# Altium project BridgeArduinoNano.PrjPcb
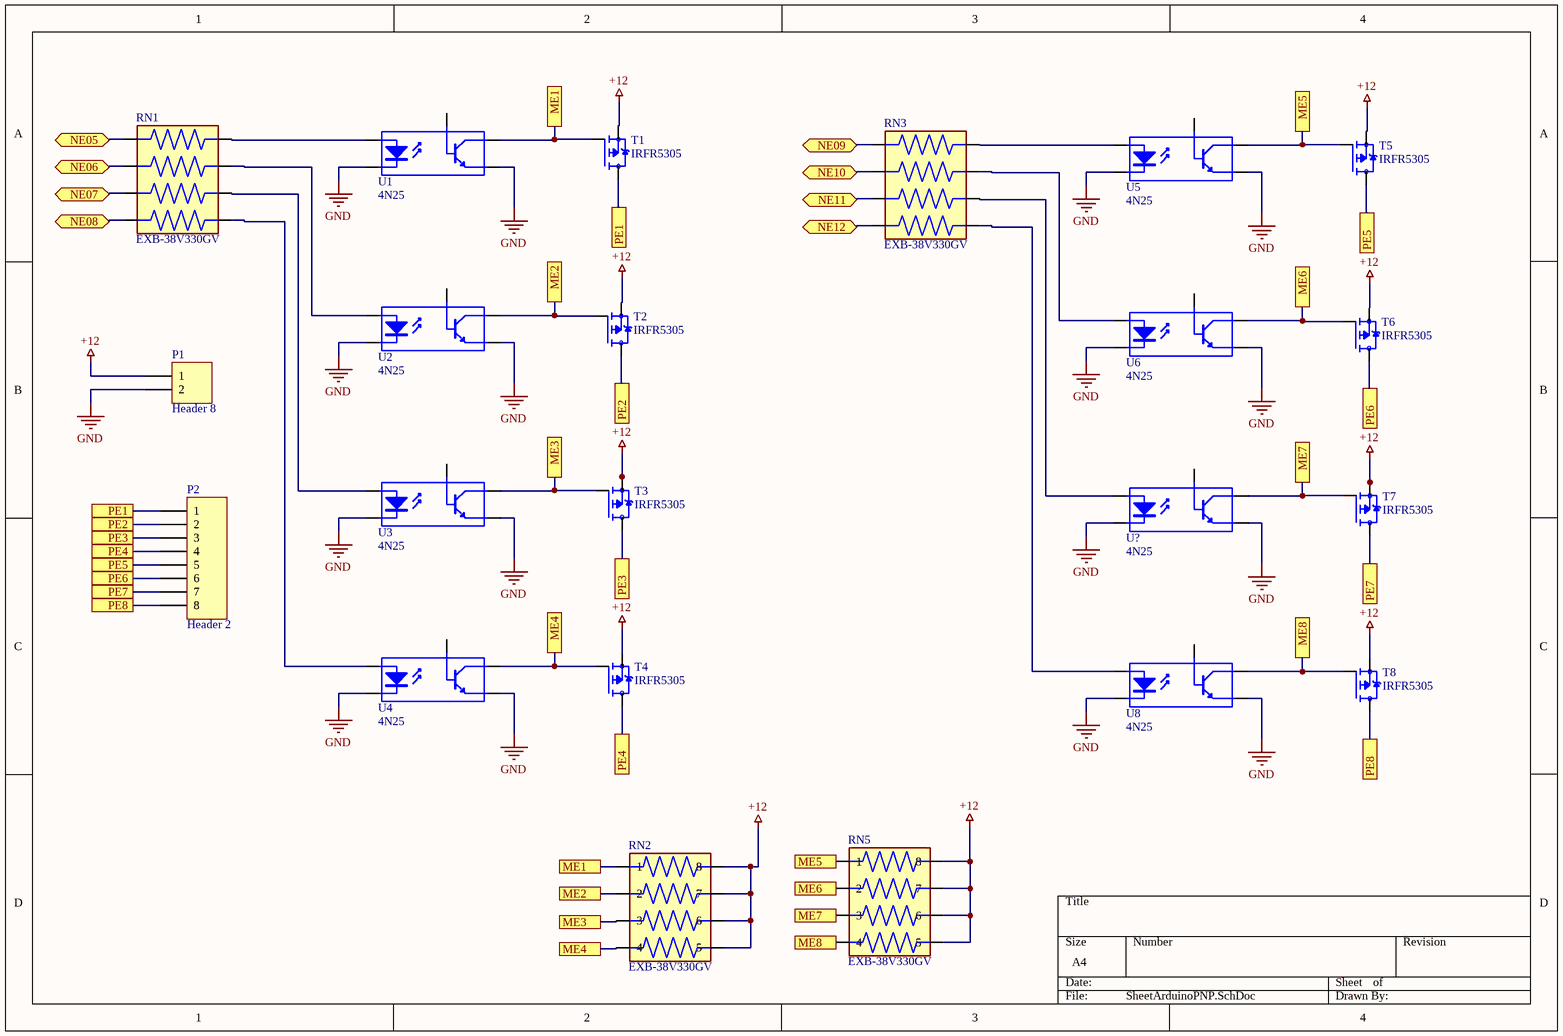
[diagram p0: SheetArduinoPNP.SchDoc]
4 sheets, 70 parts. Net scope: flat (ports and power ports of the same name join across sheets).
Board file: PCB1.PcbDoc
Sheets:
  SheetArduinoPNP.SchDoc
  SheetArduinoNPN.SchDoc
  SheetArduinoUSB.SchDoc
  SheetArduinoESP32.SchDoc

## Sheet SheetArduinoPNP.SchDoc
size A4

### Parts
P1  Header 8  [HDR1X2]
P2  Header 2  [HDR1X8]
RN1  EXB-38V330GV  [RESCAXS80P320X160X60-8N]
RN2  EXB-38V330GV  [RESCAXS80P320X160X60-8N]
RN3  EXB-38V330GV  [RESCAXS80P320X160X60-8N]
RN5  EXB-38V330GV  [RESCAXS80P320X160X60-8N]
T1  IRFR5305  [D-PAK_TO252AA]
T2  IRFR5305  [D-PAK_TO252AA]
T3  IRFR5305  [D-PAK_TO252AA]
T4  IRFR5305  [D-PAK_TO252AA]
T5  IRFR5305  [D-PAK_TO252AA]
T6  IRFR5305  [D-PAK_TO252AA]
T7  IRFR5305  [D-PAK_TO252AA]
T8  IRFR5305  [D-PAK_TO252AA]
U1  4N25  [SOP5(6)]
U2  4N25  [SOP5(6)]
U3  4N25  [SOP5(6)]
U4  4N25  [SOP5(6)]
U5  4N25  [SOP5(6)]
U6  4N25  [SOP5(6)]
U8  4N25  [SOP5(6)]
U?  4N25  [SOP5(6)]

### Ports
ME1, ME2, ME3, ME4, ME5, ME6, ME7, ME8, NE05 (bidir), NE06 (bidir), NE07 (bidir), NE08 (bidir), NE09 (bidir), NE10 (bidir), NE11 (bidir), NE12 (bidir), PE1, PE2, PE3, PE4, PE5, PE6, PE7, PE8

### Nets
+12: P1.1 RN2.5 RN2.6 RN2.7 RN2.8 RN5.5 RN5.6 RN5.7 RN5.8 T1.3(S) T2.3(S) T3.3(S) T4.3(S) T5.3(S) T6.3(S) T7.3(S) T8.3(S)
GND: P1.2 U1.3(K) U1.4(E) U2.3(K) U2.4(E) U3.3(K) U3.4(E) U4.3(K) U4.4(E) U5.3(K) U5.4(E) U6.3(K) U6.4(E) U8.3(K) U8.4(E) U?.3(K) U?.4(E)
NetJ1_02: RN3.1 ; port NE09
NetJ1_04: RN3.2 ; port NE10
NetJ1_06: RN3.3 ; port NE11
NetJ1_08: RN3.4 ; port NE12
NetJ1_09: RN1.1 ; port NE05
NetJ1_11: RN1.2 ; port NE06
NetJ1_13: RN1.3 ; port NE07
NetJ1_15: RN1.4 ; port NE08
NetP2_1: P2.1 T1.4(D) ; port PE1
NetP2_2: P2.2 T2.4(D) ; port PE2
NetP2_3: P2.3 T3.4(D) ; port PE3
NetP2_4: P2.4 T4.4(D) ; port PE4
NetP2_5: P2.5 T5.4(D) ; port PE5
NetP2_6: P2.6 T6.4(D) ; port PE6
NetP2_7: P2.7 T7.4(D) ; port PE7
NetP2_8: P2.8 T8.4(D) ; port PE8
NetRN1_5: RN1.5 U4.5(C)
NetRN1_6: RN1.6 U3.5(C)
NetRN1_7: RN1.7 U2.5(C)
NetRN1_8: RN1.8 U1.5(C)
NetRN2_1: RN2.1 T1.1(G) U1.1(A) ; port ME1
NetRN2_2: RN2.2 T2.1(G) U2.1(A) ; port ME2
NetRN2_3: RN2.3 T3.1(G) U3.5(C) ; port ME3
NetRN2_4: RN2.4 T4.1(G) U4.1(A) ; port ME4
NetRN3_5: RN3.5 U8.5(C)
NetRN3_6: RN3.6 U?.5(C)
NetRN3_7: RN3.7 U6.5(C)
NetRN3_8: RN3.8 U5.5(C)
NetRN5_1: RN5.1 T5.1(G) U5.1(A) ; port ME5
NetRN5_2: RN5.2 T6.1(G) U6.1(A) ; port ME6
NetRN5_3: RN5.3 T7.1(G) U?.1(A) ; port ME7
NetRN5_4: RN5.4 T8.1(G) U8.1(A) ; port ME8

Not connected (* = marked no-connect by the designer): U1 6(B); U2 6(B); U3 6(B); U4 6(B); U5 6(B); U6 6(B); U8 6(B); U? 6(B)

### Library data of the parts
P1 = Header 2: Header, 2-Pin; LatestRevisionDate: 17-Jul-2002; LatestRevisionNote: Re-released for DXP Platform.; Publisher: Altium Limited
P2 = Header 8: Header, 8-Pin; LatestRevisionDate: 17-Jul-2002; LatestRevisionNote: Re-released for DXP Platform.; Publisher: Altium Limited
RN1-RN3 RN5 = EXB-38V330GV: Resistor Array, Chip, 4 elements CONVEX 1206 2%; MF: Panasonic; SnapEDA_Link: https://www.snapeda.com/parts/EXB-38V330GV/Panasonic/view-part/1421932/?ref=snap; Price: None; MP: EXB-38V330GV; Package: 0603 Panasonic; Value: *; Check_prices: https://www.snapeda.com/parts/EXB-38V330GV/Panasonic/view-part/1421932/?ref=eda; Availability: Bad
T1-T8 = IRFR5305: P-Channel 55V 31A _Tc_ 110W _Tc_ Surface Mount D-Pak; MF: Infineon Technologies; Availability: Unavailable; Value: *; Package: TO-252-3 Infineon Technologies; Price: None; SnapEDA_Link: https://www.snapeda.com/parts/IRFR5305/Infineon%20Technologies/view-part/2877715/?ref=snap; MP: IRFR5305
U1-U6 U8 U? = Optoisolator2: 5 Pin Mini Flat Pack Optocoupler; Published: 24-Mar-1999; LatestRevisionDate: 04-Mar-2005; LatestRevisionNote: PCB Footprint replaced, Sch pins re-numbered.; DatasheetVersion: Apr-2004; PackageReference: SOP5(6); Publisher: Altium Limited; PackageDescription: Small Outline; 6 Leads (1 Absent); Body Width 4.4 mm; Pitch 1.27 mm

## Sheet SheetArduinoNPN.SchDoc
size A4
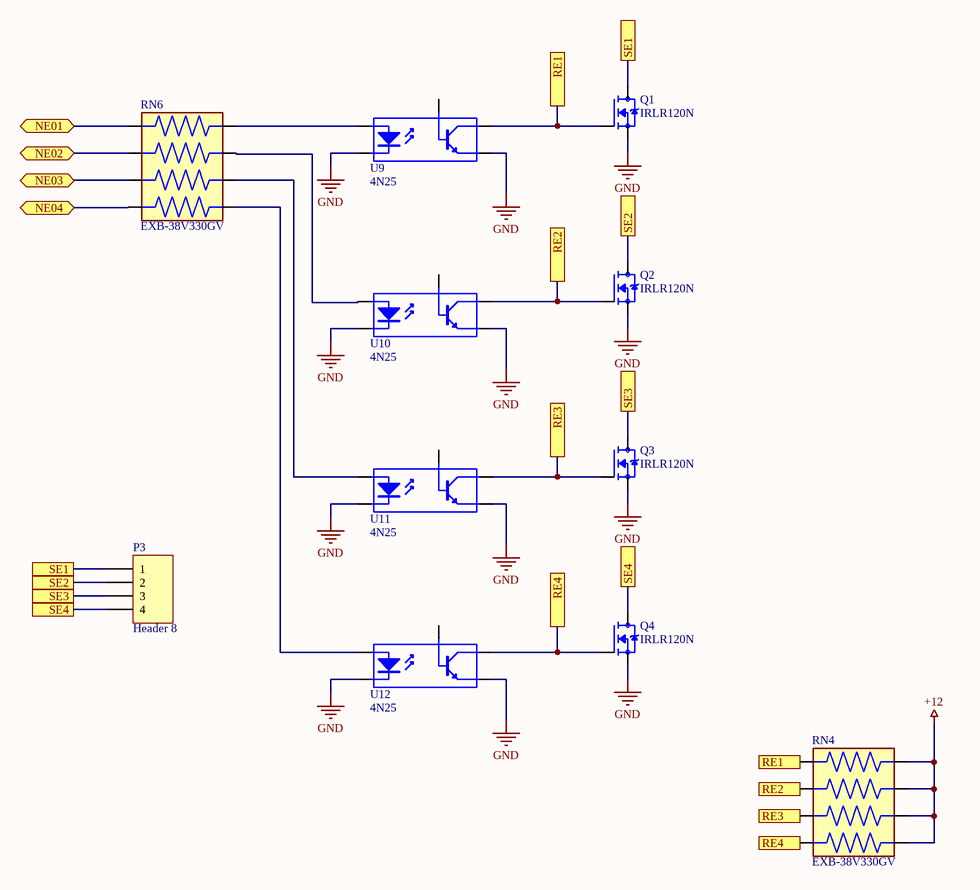
[diagram p1: SheetArduinoNPN.SchDoc]

### Parts
P3  Header 8  [HDR1X4]
Q1  IRLR120N  [DPAK229P990X239-3N]
Q2  IRLR120N  [DPAK229P990X239-3N]
Q3  IRLR120N  [DPAK229P990X239-3N]
Q4  IRLR120N  [DPAK229P990X239-3N]
RN4  EXB-38V330GV  [RESCAXS80P320X160X60-8N]
RN6  EXB-38V330GV  [RESCAXS80P320X160X60-8N]
U9  4N25  [SOP5(6)]
U10  4N25  [SOP5(6)]
U11  4N25  [SOP5(6)]
U12  4N25  [SOP5(6)]

### Ports
NE01 (bidir), NE02 (bidir), NE03 (bidir), NE04 (bidir), RE1, RE2, RE3, RE4, SE1, SE2, SE3, SE4

### Nets
+12: RN4.5 RN4.6 RN4.7 RN4.8
GND: Q1.2(S) Q2.2(S) Q3.2(S) Q4.2(S) U9.3(K) U9.4(E) U10.3(K) U10.4(E) U11.3(K) U11.4(E) U12.3(K) U12.4(E)
NetJ1_01: RN6.1 ; port NE01
NetJ1_03: RN6.2 ; port NE02
NetJ1_05: RN6.3 ; port NE03
NetJ1_07: RN6.4 ; port NE04
NetP3_1: P3.1 Q1.3(D) ; port SE1
NetP3_2: P3.2 Q2.3(D) ; port SE2
NetP3_3: P3.3 Q3.3(D) ; port SE3
NetP3_4: P3.4 Q4.3(D) ; port SE4
NetQ1_1: Q1.1(G) RN4.1 U9.5(C) ; port RE1
NetQ2_1: Q2.1(G) RN4.2 U10.5(C) ; port RE2
NetQ3_3: Q3.3(D) RN4.3 U11.5(C) ; port RE3
NetQ4_1: Q4.1(G) RN4.4 U12.5(C) ; port RE4
NetRN6_5: RN6.5 U12.1(A)
NetRN6_6: RN6.6 U11.1(A)
NetRN6_7: RN6.7 U10.1(A)
NetRN6_8: RN6.8 U9.1(A)

Not connected (* = marked no-connect by the designer): U9 6(B); U10 6(B); U11 6(B); U12 6(B)

### Library data of the parts
P3 = Header 4: Header, 4-Pin; LatestRevisionDate: 17-Jul-2002; LatestRevisionNote: Re-released for DXP Platform.; Publisher: Altium Limited
Q1-Q4 = IRLR120N: N-Channel 100V 10A _Tc_ 48W _Tc_ Surface Mount D-Pak; MF: Infineon Technologies; Price: None; SnapEDA_Link: https://www.snapeda.com/parts/IRLR120N/Infineon%20Technologies/view-part/182771/?ref=snap; Package: TO-252 International Rectifier; Availability: Unavailable; MP: IRLR120N; Value: *
RN4 RN6 = EXB-38V330GV: as RN1 on sheet SheetArduinoPNP; SnapEDA_Link: https://www.snapeda.com/parts/EXB-38V330GV/Panasonic/view-part/1421932/?ref=snap; Price: None; MP: EXB-38V330GV; Package: 0603 Panasonic; Value: *; Check_prices: https://www.snapeda.com/parts/EXB-38V330GV/Panasonic/view-part/1421932/?ref=eda; Availability: Bad
U9-U12 = Optoisolator2: 5 Pin Mini Flat Pack Optocoupler; Published: 24-Mar-1999; LatestRevisionDate: 04-Mar-2005; LatestRevisionNote: PCB Footprint replaced, Sch pins re-numbered.; DatasheetVersion: Apr-2004; PackageReference: SOP5(6); Publisher: Altium Limited; PackageDescription: Small Outline; 6 Leads (1 Absent); Body Width 4.4 mm; Pitch 1.27 mm

## Sheet SheetArduinoUSB.SchDoc
size A4
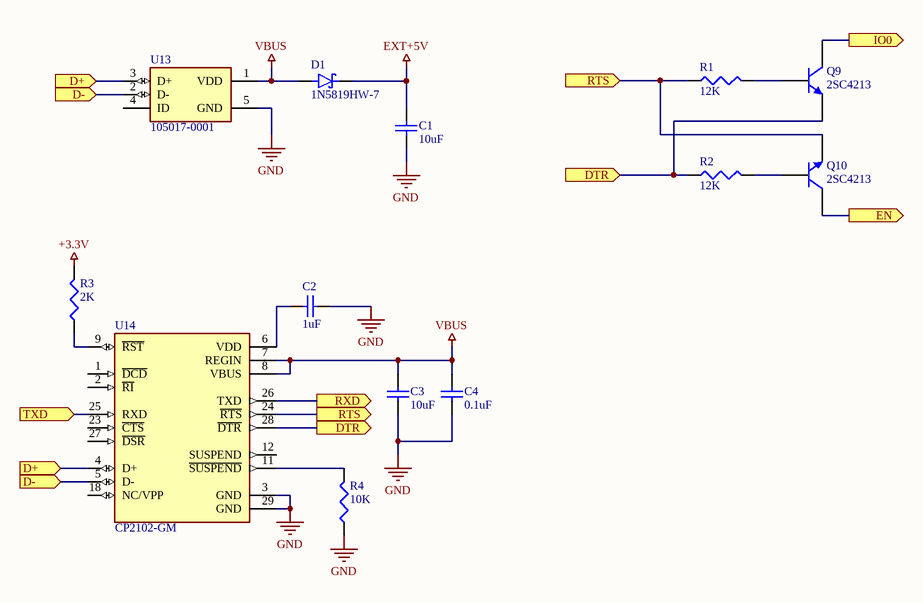
[diagram p2: SheetArduinoUSB.SchDoc]

### Parts
C1  10uF  [C1206]
C2  1uF  [1608[0603]]
C3  10uF  [C1206]
C4  0.1uF  [1608[0603]]
D1  1N5819HW-7  [SOD3715X145N]
Q9  2SC4213  [SOT-23B_N]
Q10  2SC4213  [SOT-23B_N]
R1  12K  [J1-0603]
R2  12K  [J1-0603]
R3  2K  [J1-0603]
R4  10K  [J1-0603]
U13  105017-0001  [MOLEX_105017-0001]
U14  CP2102-GM  [QFN50P500X500X100-29N]

### Ports
D+ (in), D- (in), DTR (in), DTR (out), EN (out), IO0 (out), RTS (in), RTS (out), RXD (out), TXD (in)

### Nets
+3.3V: R3.2
EXT+5V: C1.2 D1.C(K)
GND: C1.1 C2.1 C3.1 C4.1 R4.1 U13.5(GND) U14.3(GND) U14.29(GND)
VBUS: C3.2 C4.2 D1.A U13.1(VDD) U14.7(REGIN) U14.8(VBUS)
NetC2_2: C2.2 U14.6(VDD)
NetQ9_1: Q9.1(C) ; port IO0
NetQ9_2: Q9.2(B) R1.2
NetQ9_3: Q9.3(E) R2.1 U14.28(~{DTR}) ; port DTR
NetQ10_1: Q10.1(C) ; port EN
NetQ10_2: Q10.2(B) R2.2
NetQ10_3: Q10.3(E) R1.1 U14.24(~{RTS}) ; port RTS
NetR3_1: R3.1 U14.9(~{RST})
NetR4_2: R4.2 U14.11(~{SUSPEND})
NetU13_2: U13.2(D-) U14.5(D-) ; port D-
NetU13_3: U13.3(D+) U14.4(D+) ; port D+
NetU14_25: U14.25(RXD) ; port TXD
NetU14_26: U14.26(TXD) ; port RXD

Not connected (* = marked no-connect by the designer): U13 4(ID); U14 1(~{DCD}) 2(~{RI}) 12(SUSPEND) 18(NC/VPP) 23(~{CTS}) 27(~{DSR})

### Library data of the parts
C1-C4 = Cap Semi: Capacitor (Semiconductor SIM Model); Published: 8-Jun-2000; LatestRevisionDate: 29-May-2009; LatestRevisionNote: IPC-7351 Footprint Added.; PackageReference: C1206; Publisher: Altium Limited; PackageDescription: Chip Capacitor
D1 = 1N5819HW-7: Diode Schottky 40 V 1A Surface Mount SOD-123; MF: Diodes Inc.; SnapEDA_Link: https://www.snapeda.com/parts/1N5819HW-7/Diodes+Inc./view-part/?ref=snap; Price: None; Check_prices: https://www.snapeda.com/parts/1N5819HW-7/Diodes+Inc./view-part/?ref=eda; Availability: In Stock; Value: *; MP: 1N5819HW-7; Package: SOD-123 Fairchild Semiconductor; Purchase-URL: https://pricing.snapeda.com/search/part/1N5819HW-7/?ref=eda
Q9 Q10 = QNPN: NPN Bipolar Transistor; Published: 8-Jun-2000; LatestRevisionDate: 29-May-2009; LatestRevisionNote: IPC-7351 Footprint Added.; PackageVersion: Aug-1999; PackageReference: SOT-23B; Publisher: Altium Limited; PackageDescription: 3-Pin SOT-23 Package 0.95 mm Pitch, 2.4 mm Lead Span
R1-R4 = Res3: Resistor; Published: 8-Jun-2000; LatestRevisionDate: 29-May-2009; LatestRevisionNote: IPC-7351 Footprint Added.; PackageReference: J1-0603; Publisher: Altium Limited; PackageDescription: Chip Resistor
U13 = 105017-0001: USB - micro B USB 2.0 Receptacle Connector 5 Position Surface Mount, Right Angle; Through Hole; MF: Molex; Price: None; Package: None; MP: 105017-0001; Value: *; Availability: Unavailable; SnapEDA_Link: https://www.snapeda.com/parts/105017-0001/Molex/view-part/281210/?ref=snap
U14 = CP2102-GM: USB Bridge, USB to UART USB 2.0 UART Interface 28-QFN _5x5_; MF: Silicon Labs; Package: QFN-28 Silicon Labs; Value: *; Price: None; MP: CP2102-GM; Availability: Unavailable; SnapEDA_Link: https://www.snapeda.com/parts/CP2102-GM/Silicon%20Labs/view-part/135876/?ref=snap

## Sheet SheetArduinoESP32.SchDoc
size A4
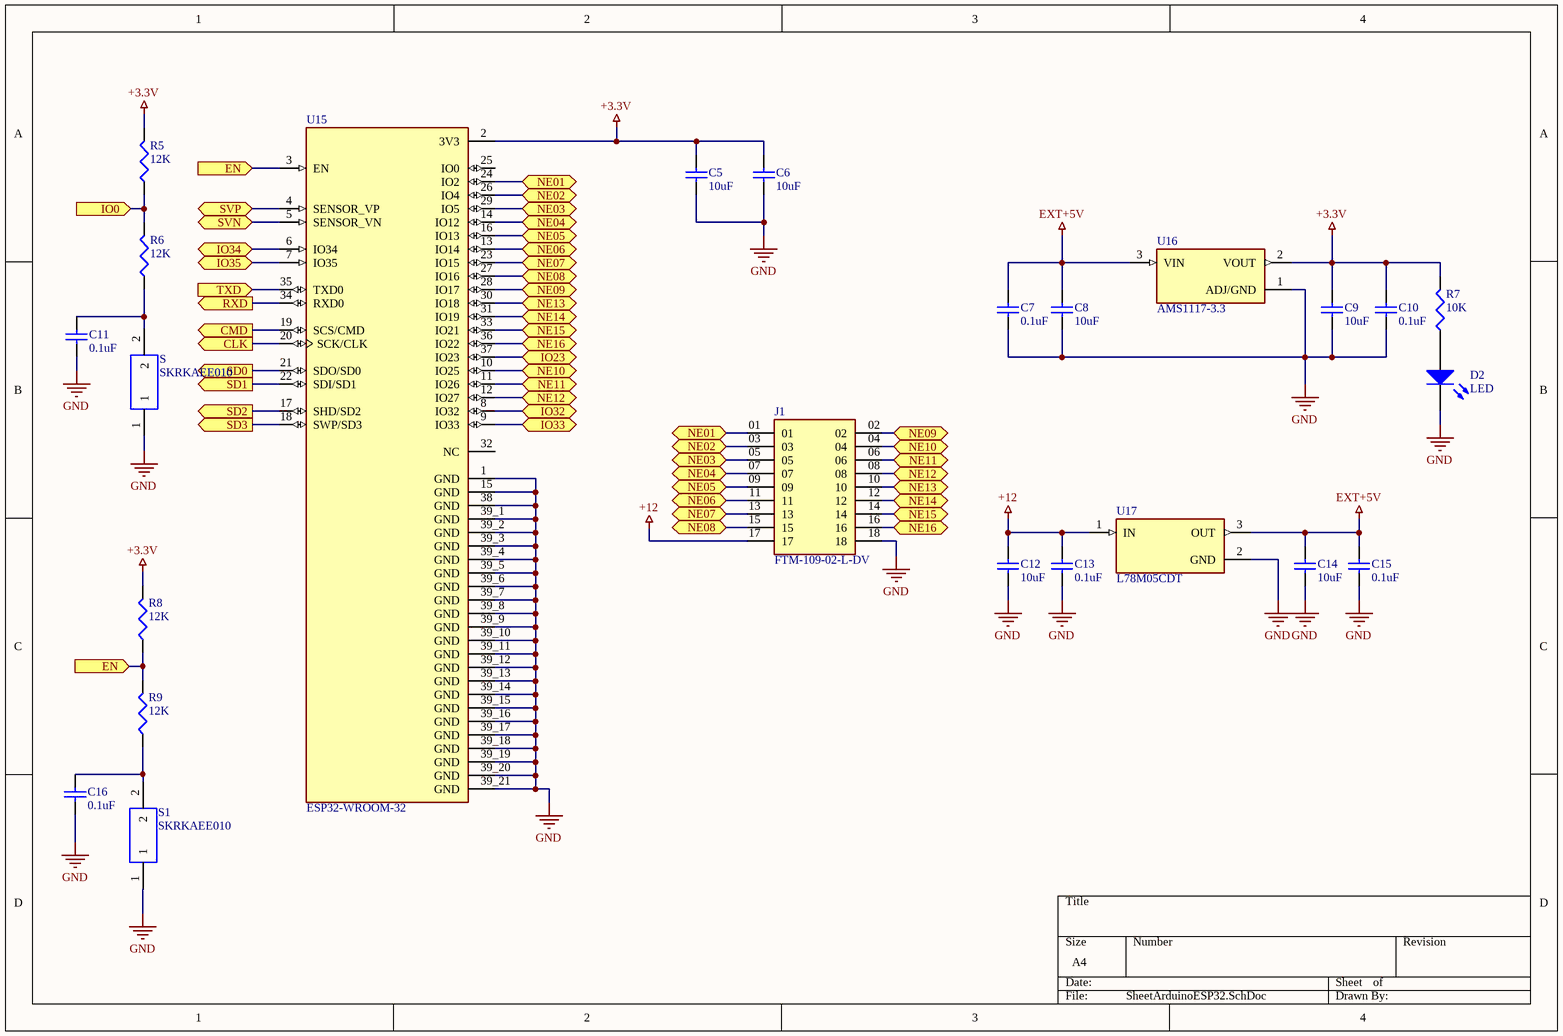
[diagram p3: SheetArduinoESP32.SchDoc]

### Parts
C5  10uF  [C1206]
C6  10uF  [C1206]
C7  0.1uF  [1608[0603]]
C8  10uF  [C1206]
C9  10uF  [C1206]
C10  0.1uF  [1608[0603]]
C11  0.1uF  [1608[0603]]
C12  10uF  [C1206]
C13  0.1uF  [1608[0603]]
C14  10uF  [C1206]
C15  0.1uF  [1608[0603]]
C16  0.1uF  [1608[0603]]
D2  LED  [3.5X2.8X1.9]
J1  FTM-109-02-L-DV  [SAMTEC_FTM-109-02-L-DV]
R5  12K  [J1-0603]
R6  12K  [J1-0603]
R7  10K  [J1-0603]
R8  12K  [J1-0603]
R9  12K  [J1-0603]
S  SKRKAEE010  [SKRK]
S1  SKRKAEE010  [SKRK]
U15  ESP32-WROOM-32  [MODULE_ESP32-WROOM-32]
U16  AMS1117-3.3  [SOT229P700X180-4N]
U17  L78M05CDT  [VREG_L78M05CDT]

### Ports
CLK (out), CMD (out), EN (in), IO0 (in), IO23 (bidir), IO32 (bidir), IO33 (bidir), IO34 (bidir), IO35 (bidir), NE01 (bidir), NE02 (bidir), NE03 (bidir), NE04 (bidir), NE05 (bidir), NE06 (bidir), NE07 (bidir), NE08 (bidir), NE09 (bidir), NE10 (bidir), NE11 (bidir), NE12 (bidir), NE13 (bidir), NE14 (bidir), NE15 (bidir), NE16 (bidir), RXD (out), SD0 (out), SD1 (out), SD2 (out), SD3 (out), SVN (bidir), SVP (bidir), TXD (in)

### Nets
+3.3V: C5.2 C6.2 C9.2 C10.2 R5.2 R7.2 R8.2 U15.2(3V3) U16.2(VOUT)
+12: C12.2 C13.2 J1.17 U17.1(IN)
EXT+5V: C7.2 C8.2 C14.2 C15.2 U16.3(VIN) U17.3(OUT)
GND: C5.1 C6.1 C7.1 C8.1 C9.1 C10.1 C11.1 C12.1 C13.1 C14.1 C15.1 C16.1 D2.2(K) J1.18 S.1 S1.1 U15.1(GND) U15.15(GND) U15.38(GND) U15.39_1(GND) U15.39_2(GND) U15.39_3(GND) U15.39_4(GND) U15.39_5(GND) U15.39_6(GND) U15.39_7(GND) U15.39_8(GND) U15.39_9(GND) U15.39_10(GND) U15.39_11(GND) U15.39_12(GND) U15.39_13(GND) U15.39_14(GND) U15.39_15(GND) U15.39_16(GND) U15.39_17(GND) U15.39_18(GND) U15.39_19(GND) U15.39_20(GND) U15.39_21(GND) U16.1(ADJ/GND) U17.2(GND)
NetC11_2: C11.2 R6.1 S.2
NetC16_2: C16.2 R9.1 S1.2
NetD2_1: D2.1(A) R7.1
NetJ1_01: J1.01 U15.24(IO2) ; port NE01
NetJ1_02: J1.02 U15.28(IO17) ; port NE09
NetJ1_03: J1.03 U15.26(IO4) ; port NE02
NetJ1_04: J1.04 U15.10(IO25) ; port NE10
NetJ1_05: J1.05 U15.29(IO5) ; port NE03
NetJ1_06: J1.06 U15.11(IO26) ; port NE11
NetJ1_07: J1.07 U15.14(IO12) ; port NE04
NetJ1_08: J1.08 U15.12(IO27) ; port NE12
NetJ1_09: J1.09 U15.16(IO13) ; port NE05
NetJ1_10: J1.10 U15.30(IO18) ; port NE13
NetJ1_11: J1.11 U15.13(IO14) ; port NE06
NetJ1_12: J1.12 U15.31(IO19) ; port NE14
NetJ1_13: J1.13 U15.23(IO15) ; port NE07
NetJ1_14: J1.14 U15.33(IO21) ; port NE15
NetJ1_15: J1.15 U15.27(IO16) ; port NE08
NetJ1_16: J1.16 U15.36(IO22) ; port NE16
NetQ9_1: R5.1 R6.2 ; port IO0
NetQ10_1: R8.1 R9.2 U15.3(EN) ; port EN
NetU14_25: U15.35(TXD0) ; port TXD
NetU14_26: U15.34(RXD0) ; port RXD
NetU15_4: U15.4(SENSOR_VP) ; port SVP
NetU15_5: U15.5(SENSOR_VN) ; port SVN
NetU15_6: U15.6(IO34) ; port IO34
NetU15_7: U15.7(IO35) ; port IO35
NetU15_8: U15.8(IO32) ; port IO32
NetU15_9: U15.9(IO33) ; port IO33
NetU15_17: U15.17(SHD/SD2) ; port SD2
NetU15_18: U15.18(SWP/SD3) ; port SD3
NetU15_19: U15.19(SCS/CMD) ; port CMD
NetU15_20: U15.20(SCK/CLK) ; port CLK
NetU15_21: U15.21(SDO/SD0) ; port SD0
NetU15_22: U15.22(SDI/SD1) ; port SD1
NetU15_37: U15.37(IO23) ; port IO23

Not connected (* = marked no-connect by the designer): U15 25(IO0) 32(NC)

### Library data of the parts
C5-C16 = Cap Semi: Capacitor (Semiconductor SIM Model); Published: 8-Jun-2000; LatestRevisionDate: 29-May-2009; LatestRevisionNote: IPC-7351 Footprint Added.; PackageReference: C1206; Publisher: Altium Limited; PackageDescription: Chip Capacitor
D2 = LED3: Typical BLUE SiC LED; Published: 8-Jun-2000; LatestRevisionDate: 17-Dec-2003; LatestRevisionNote: PCB Footprint replaced.; DatasheetVersion: 16-Apr-2002; PackageVersion: 16-Apr-2002; PackageReference: 3.5X2.8X1.9; Publisher: Altium Limited; PackageDescription: SM LED; 2 C-Bend Leads; Body 3.5 x 2.8 x 1.9 mm, inc leads (LxWxH typ)
R5-R9 = Res3: Resistor; Published: 8-Jun-2000; LatestRevisionDate: 29-May-2009; LatestRevisionNote: IPC-7351 Footprint Added.; PackageReference: J1-0603; Publisher: Altium Limited; PackageDescription: Chip Resistor
S S1 = SKRKAEE010: Switch Tactile N.O. SPST Round Button Gull Wing 0.05A 12VDC 1.57N SMD T/R; MF: ALPS; Availability: Unavailable; Price: None; Package: None; Value: *; SnapEDA_Link: https://www.snapeda.com/parts/SKRKAEE010/ALPS/view-part/380772/?ref=snap; MP: SKRKAEE010
U15 = ESP32-WROOM-32: Bluetooth, WiFi 802.11b/g/n, Bluetooth v4.2 +EDR, Class 1, 2 and 3 Transceiver Module 2.4GHz ~ 2.5GHz Antenna Not Included, U.FL Surface Mount; MF: Espressif Systems; MP: ESP32-WROOM-32; Purchase-URL: https://pricing.snapeda.com/search/part/ESP32-WROOM-32/?ref=eda; Package: Module Espressif Systems; Value: *; Digi-Key_Part_Number: 1965-ESP32-WROOM-32U-N4CT-ND; Check_prices: https://www.snapeda.com/parts/ESP32-WROOM-32/Espressif+Systems/view-part/?ref=eda; SnapEDA_Link: https://www.snapeda.com/parts/ESP32-WROOM-32/Espressif+Systems/view-part/?ref=snap
U16 = AMS1117-3.3: Sot223/Pkg 1-Amp 3.3-Volt Low Drop Out Voltage Regulatator; MF: Advanced Monolithic Systems; Price: None; Package: None; Value: *; MP: AMS1117-3.3; Availability: Unavailable; SnapEDA_Link: https://www.snapeda.com/parts/AMS1117-3.3/Advanced%20Monolithic%20Systems/view-part/53450/?ref=snap
U17 = L78M05CDT: 7805 based precision 5V fixed regulator with output current of up to 500mA and wide temperature operating range of 0Â°C to 150Â°C.; MF: STMicroelectronics; Package: TO-252-3 STMicroelectronics; MP: L78M05CDT; Value: *; Availability: In Stock; SnapEDA_Link: https://www.snapeda.com/parts/L78M05CDT/STMicroelectronics/view-part/?ref=snap; Price: None; Check_prices: https://www.snapeda.com/parts/L78M05CDT/STMicroelectronics/view-part/?ref=eda
J1 = FTM-109-02-L-DV: Package: None; Price: None; Value: *; MP: FTM-109-02-L-DV; Availability: Unavailable

## Nets that join several sheets
+3.3V: SheetArduinoUSB (R3.2), SheetArduinoESP32 (9 pins)
+12: SheetArduinoPNP (17 pins), SheetArduinoNPN (RN4.5 RN4.6 RN4.7 RN4.8), SheetArduinoESP32 (C12.2 C13.2 J1.17 U17.1)
EXT+5V: SheetArduinoUSB (C1.2 D1.C), SheetArduinoESP32 (6 pins)
GND: SheetArduinoPNP (17 pins), SheetArduinoNPN (12 pins), SheetArduinoUSB (8 pins), SheetArduinoESP32 (42 pins)
NetJ1_01: SheetArduinoNPN (RN6.1), SheetArduinoESP32 (J1.01 U15.24)
NetJ1_02: SheetArduinoPNP (RN3.1), SheetArduinoESP32 (J1.02 U15.28)
NetJ1_03: SheetArduinoNPN (RN6.2), SheetArduinoESP32 (J1.03 U15.26)
NetJ1_04: SheetArduinoPNP (RN3.2), SheetArduinoESP32 (J1.04 U15.10)
NetJ1_05: SheetArduinoNPN (RN6.3), SheetArduinoESP32 (J1.05 U15.29)
NetJ1_06: SheetArduinoPNP (RN3.3), SheetArduinoESP32 (J1.06 U15.11)
NetJ1_07: SheetArduinoNPN (RN6.4), SheetArduinoESP32 (J1.07 U15.14)
NetJ1_08: SheetArduinoPNP (RN3.4), SheetArduinoESP32 (J1.08 U15.12)
NetJ1_09: SheetArduinoPNP (RN1.1), SheetArduinoESP32 (J1.09 U15.16)
NetJ1_11: SheetArduinoPNP (RN1.2), SheetArduinoESP32 (J1.11 U15.13)
NetJ1_13: SheetArduinoPNP (RN1.3), SheetArduinoESP32 (J1.13 U15.23)
NetJ1_15: SheetArduinoPNP (RN1.4), SheetArduinoESP32 (J1.15 U15.27)
NetQ9_1: SheetArduinoUSB (Q9.1), SheetArduinoESP32 (R5.1 R6.2)
NetQ10_1: SheetArduinoUSB (Q10.1), SheetArduinoESP32 (R8.1 R9.2 U15.3)
NetU14_25: SheetArduinoUSB (U14.25), SheetArduinoESP32 (U15.35)
NetU14_26: SheetArduinoUSB (U14.26), SheetArduinoESP32 (U15.34)